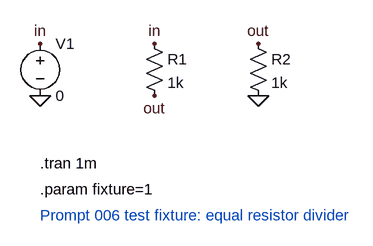
[diagram p0: schematic dc_divider.asc]
dc_divider.asc, the LTspice schematic file:
Version 4
SHEET 1 880 680
FLAG 0 16 in
FLAG 0 96 0
FLAG 176 16 in
FLAG 176 96 out
FLAG 336 16 out
FLAG 336 96 0
SYMBOL voltage 0 0 R0
SYMATTR InstName V1
SYMATTR Value 0
SYMBOL res 160 0 R0
SYMATTR InstName R1
SYMATTR Value 1k
SYMBOL res 320 0 R0
SYMATTR InstName R2
SYMATTR Value 1k
TEXT 0 200 Left 2 !.tran 1m
TEXT 0 240 Left 2 !.param fixture=1
TEXT 0 280 Left 2 ;Prompt 006 test fixture: equal resistor divider

The netlist it stands for:
* dc_divider.asc
V1 in 0 0
R1 in out 1k
R2 out 0 1k
.tran 1m
.param fixture=1
* Prompt 006 test fixture: equal resistor divider
.backanno
.end